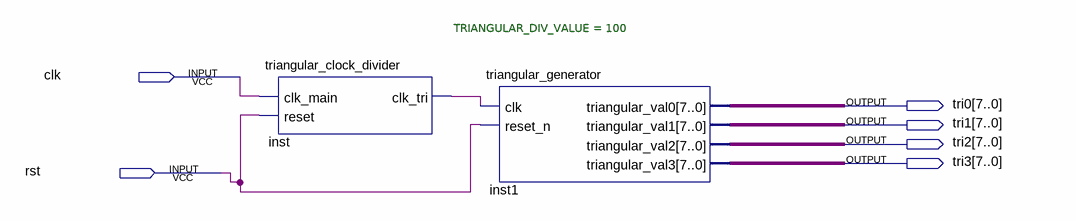
[diagram p0: schematic sheet]
// Quartus schematic triang.bdf as structural Verilog: 2 symbols, 6 pins
module triang (
  input  clk,
  input  rst,
  output [7:0] \tri0 ,
  output [7:0] \tri1 ,
  output [7:0] tri2,
  output [7:0] tri3
);

  wire inst_clk_tri;

  triangular_clock_divider #(.TRIANGULAR_DIV_VALUE(100)) inst (.clk_main(clk), .reset(rst), .clk_tri(inst_clk_tri));
  triangular_generator inst1 (
    .clk(inst_clk_tri), .reset_n(rst), .triangular_val0(\tri0 ), .triangular_val1(\tri1 ),
    .triangular_val2(tri2), .triangular_val3(tri3));
endmodule
